# Altium project PCB_Project1.PrjPCB
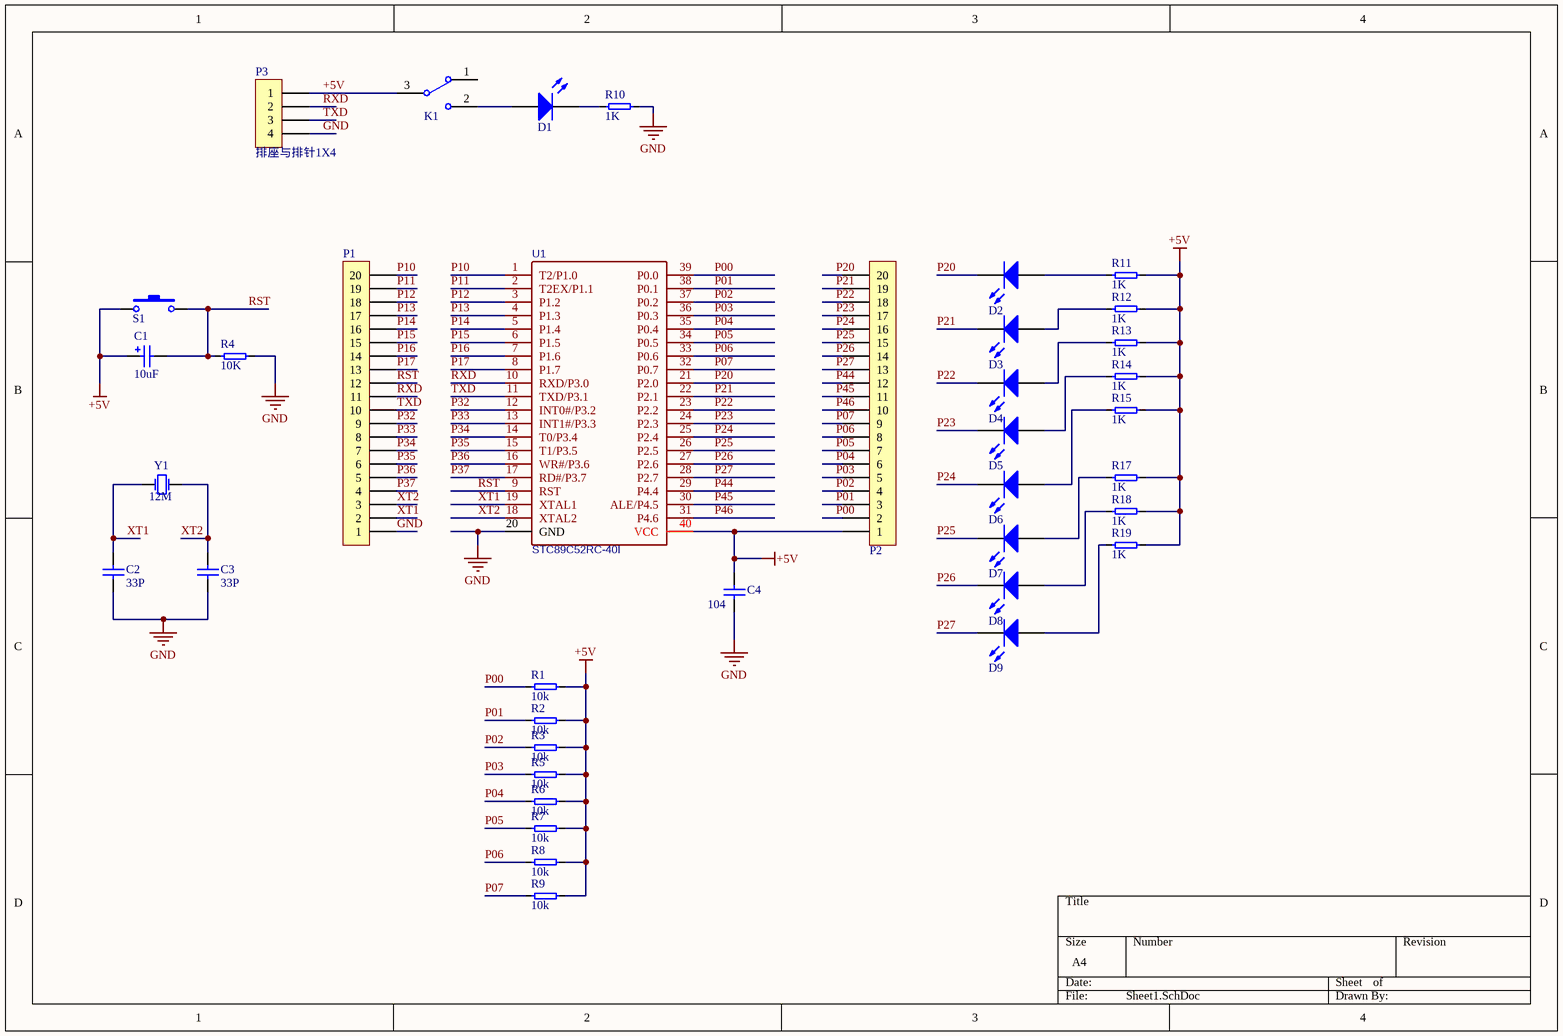
[diagram p0: Sheet1.SchDoc]
1 sheet, 38 parts. Net scope: global (net labels, ports and power ports of the same name join across sheets).
Board file: PCB1.PcbDoc

## Sheet Sheet1.SchDoc
size A4

### Parts
C1  10uF  [CAP4*7]
C2  33P  [0805-C]
C3  33P  [0805-C]
C4  104  [0805-C]
D1  LED  [LED-BLUE-0805]  (value not drawn)
D2  LED  [LED-BLUE-0805]  (value not drawn)
D3  LED  [LED-BLUE-0805]  (value not drawn)
D4  LED  [LED-BLUE-0805]  (value not drawn)
D5  LED  [LED-BLUE-0805]  (value not drawn)
D6  LED  [LED-BLUE-0805]  (value not drawn)
D7  LED  [LED-BLUE-0805]  (value not drawn)
D8  LED  [LED-BLUE-0805]  (value not drawn)
D9  LED  [LED-BLUE-0805]  (value not drawn)
K1  开关  [开关(自锁)]  (value not drawn)
P1  排座与排针1X20  [Header1X20]  (value not drawn)
P2  排座与排针1X20  [Header1X20]  (value not drawn)
P3  排座与排针1X4  [Female1X4]
R1  10k  [0805-R]
R2  10k  [0805-R]
R3  10k  [0805-R]
R4  10K  [0805-R]
R5  10k  [0805-R]
R6  10k  [0805-R]
R7  10k  [0805-R]
R8  10k  [0805-R]
R9  10k  [0805-R]
R10  1K  [0805-R]
R11  1K  [0805-R]
R12  1K  [0805-R]
R13  1K  [0805-R]
R14  1K  [0805-R]
R15  1K  [0805-R]
R17  1K  [0805-R]
R18  1K  [0805-R]
R19  1K  [0805-R]
S1  按键  [按键(小)]  (value not drawn)
U1  STC89C52RC-40I  [DIP-40_LS15.24-L52.58-W13.97-H4.83-PITCH2.54]
Y1  12M  [晶振(HC49S型)]

### Nets
+5V: C1.1 C4.2 K1.3 P2.1 P3.1 R1.2 R2.2 R3.2 R5.2 R6.2 R7.2 R8.2 R9.2 R11.2 R12.2 R13.2 R14.2 R15.2 R17.2 R18.2 R19.2 S1.1 U1.40(VCC)
GND: C2.1 C3.1 C4.1 P1.1 P3.4 R4.2 R10.2 U1.20(GND)
P00: P2.2 R1.1 U1.39(P0.0)
P01: P2.3 R2.1 U1.38(P0.1)
P02: P2.4 R3.1 U1.37(P0.2)
P03: P2.5 R5.1 U1.36(P0.3)
P04: P2.6 R6.1 U1.35(P0.4)
P05: P2.7 R7.1 U1.34(P0.5)
P06: P2.8 R8.1 U1.33(P0.6)
P07: P2.9 R9.1 U1.32(P0.7)
P10: P1.20 U1.1(T2/P1.0)
P11: P1.19 U1.2(T2EX/P1.1)
P12: P1.18 U1.3(P1.2)
P13: P1.17 U1.4(P1.3)
P14: P1.16 U1.5(P1.4)
P15: P1.15 U1.6(P1.5)
P16: P1.14 U1.7(P1.6)
P17: P1.13 U1.8(P1.7)
P20: D2.2(K) P2.20 U1.21(P2.0)
P21: D3.2(K) P2.19 U1.22(P2.1)
P22: D4.2(K) P2.18 U1.23(P2.2)
P23: D5.2(K) P2.17 U1.24(P2.3)
P24: D6.2(K) P2.16 U1.25(P2.4)
P25: D7.2(K) P2.15 U1.26(P2.5)
P26: D8.2(K) P2.14 U1.27(P2.6)
P27: D9.2(K) P2.13 U1.28(P2.7)
P32: P1.9 U1.12(INT0#/P3.2)
P33: P1.8 U1.13(INT1#/P3.3)
P34: P1.7 U1.14(T0/P3.4)
P35: P1.6 U1.15(T1/P3.5)
P36: P1.5 U1.16(WR#/P3.6)
P37: P1.4 U1.17(RD#/P3.7)
P44: P2.12 U1.29(P4.4)
P45: P2.11 U1.30(ALE/P4.5)
P46: P2.10 U1.31(P4.6)
RST: C1.2 P1.12 R4.1 S1.2 U1.9(RST)
RXD: P1.11 P3.2 U1.10(RXD/P3.0)
TXD: P1.10 P3.3 U1.11(TXD/P3.1)
XT1: C2.2 P1.2 U1.19(XTAL1) Y1.1(OSC1)
XT2: C3.2 P1.3 U1.18(XTAL2) Y1.2(OSC2)
NetD1_1: D1.1(A) K1.2
NetD1_2: D1.2(K) R10.1
NetD2_1: D2.1(A) R11.1
NetD3_1: D3.1(A) R12.1
NetD4_1: D4.1(A) R13.1
NetD5_1: D5.1(A) R14.1
NetD6_1: D6.1(A) R15.1
NetD7_1: D7.1(A) R17.1
NetD8_1: D8.1(A) R18.1
NetD9_1: D9.1(A) R19.1

Not connected (* = marked no-connect by the designer): K1 1

### Library data of the parts
C1 = 电解电容: Value: *
C2-C4 = 电容: Value: *
R1-R15 R17-R19 = 电阻: Value: *
U1 = STC89C52RC-40I: BOM_Manufacturer: STC; BOM_Supplier: LCSC; BOM_Manufacturer Part: STC89C52RC-40I; image: //image.lceda.cn/szlcsc/C14022.jpg; BOM_Supplier Part: C14022; spicePre: U
Y1 = 晶振: Value: *